# Altium schematic sheet Sheet1.SchDoc
size A4
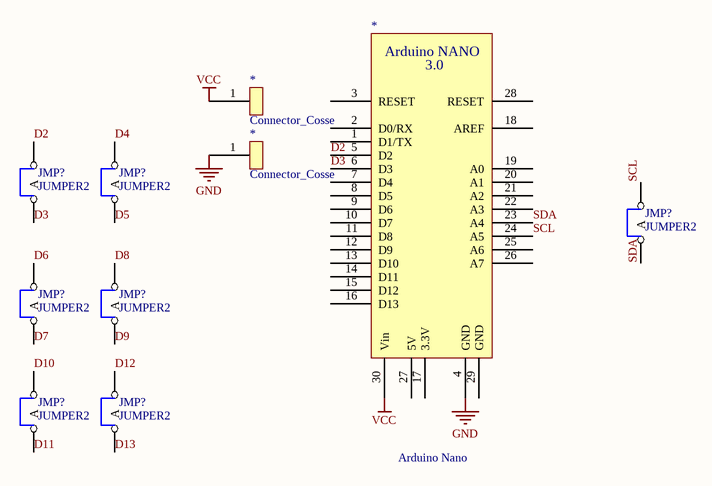
[diagram p0: Sheet1.SchDoc]

## Parts
(Parts that share a designator on the sheet are numbered #1, #2 ... from top to bottom, then left to right.)
*#1  Connector_Cosse  [Connector_Cosse]
*#2  Connector_Cosse  [Connector_Cosse]
*#3  Arduino Nano  [Arduino Nano FootPrint]
JMP?#1  JUMPER2  [JMP2-100]
JMP?#2  JUMPER2  [JMP2-100]
JMP?#3  JUMPER2  [JMP2-100]
JMP?#4  JUMPER2  [JMP2-100]
JMP?#5  JUMPER2  [JMP2-100]
JMP?#6  JUMPER2  [JMP2-100]
JMP?#7  JUMPER2  [JMP2-100]

## Nets
GND: *#2.1 *#3.4(GND)
VCC: *#1.1 *#3.30(Vin)
D2: *#3.5(D2) JMP?#1.2(com)
D3: *#3.6(D3) JMP?#1.1(A)
D4: JMP?#2.2(com)
D5: JMP?#2.1(A)
D6: JMP?#4.2(com)
D7: JMP?#4.1(A)
D8: JMP?#5.2(com)
D9: JMP?#5.1(A)
D10: JMP?#6.2(com)
D11: JMP?#6.1(A)
D12: JMP?#7.2(com)
D13: JMP?#7.1(A)
SCL: *#3.24(A5) JMP?#3.2(com)
SDA: *#3.23(A4) JMP?#3.1(A)

Not connected (* = marked no-connect by the designer): *#3 1(D1/TX) 2(D0/RX) 3(RESET) 7(D4) 8(D5) 9(D6) 10(D7) 11(D8) 12(D9) 13(D10) 14(D11) 15(D12) 16(D13) 17(3.3V) 18(AREF) 19(A0) 20(A1) 21(A2) 22(A3) 25(A6) 26(A7) 27(5V) 28(RESET) 29(GND)

## Notes on the sheet
- (in symbol Arduino Nano) Arduino NANO; 3.0

## Library data of the parts
JMP?#1-JMP?#7 = JUMPER2: cavalier 1 position